# Altium schematic sheet CD74HC4067_MUX_4.SchDoc
size A
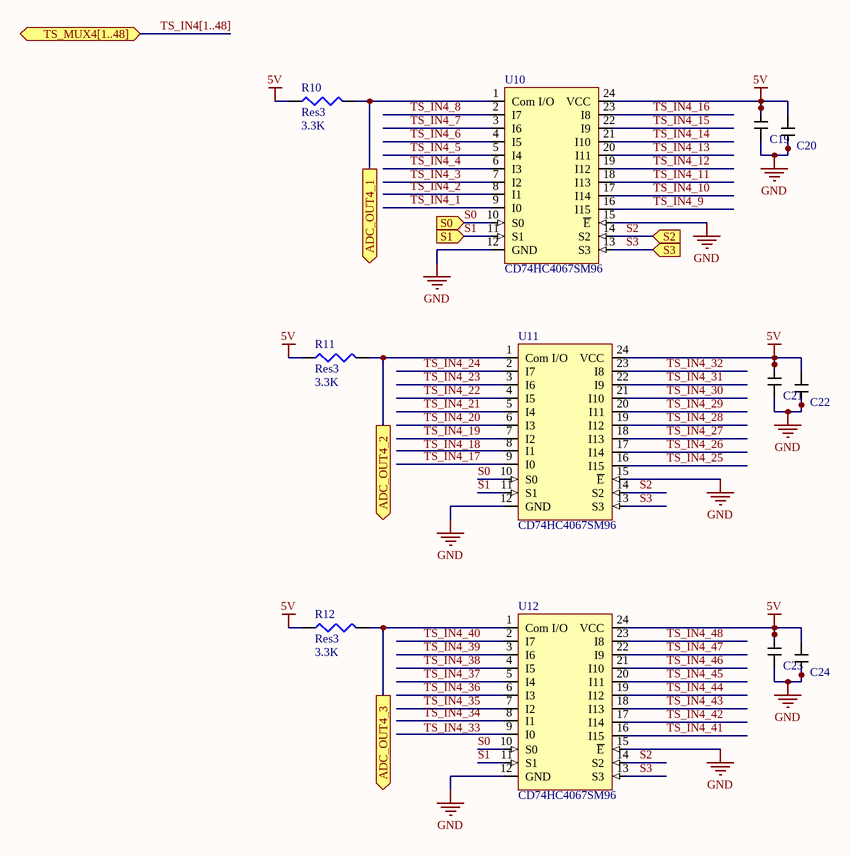
[diagram p0: CD74HC4067_MUX_4.SchDoc]

## Parts
C19  0.1uF Cap  [CAPC1608X09M]  (value not drawn)
C20  1uF Samsung Cap  [CAPC1608X09M]  (value not drawn)
C21  0.1uF Cap  [CAPC1608X09M]  (value not drawn)
C22  1uF Samsung Cap  [CAPC1608X09M]  (value not drawn)
C23  0.1uF Cap  [CAPC1608X09M]  (value not drawn)
C24  1uF Samsung Cap  [CAPC1608X09M]  (value not drawn)
R10  Res3  value 3.3K  [J1-0603]
R11  Res3  value 3.3K  [J1-0603]
R12  Res3  value 3.3K  [J1-0603]
U10  CD74HC4067SM96  [SOIC-24_MUX]
U11  CD74HC4067SM96  [SOIC-24_MUX]
U12  CD74HC4067SM96  [SOIC-24_MUX]

## Ports
ADC_OUT4_1 (out), ADC_OUT4_2 (out), ADC_OUT4_3 (out), S0 (in), S1 (in), S2 (in), S3 (in), TS_MUX4[1..48] (bidir)

## Nets
5V: C19.2 C20.2 C21.2 C22.2 C23.2 C24.2 R10.1 R11.1 R12.1 U10.24(VCC) U11.24(VCC) U12.24(VCC)
GND: C19.1 C20.1 C21.1 C22.1 C23.1 C24.1 U10.12(GND) U10.15(~{E}) U11.12(GND) U11.15(~{E}) U12.12(GND) U12.15(~{E})
ADC_OUT4_1: R10.2 U10.1(Com_I/O) ; port ADC_OUT4_1
ADC_OUT4_2: R11.2 U11.1(Com_I/O) ; port ADC_OUT4_2
ADC_OUT4_3: R12.2 U12.1(Com_I/O) ; port ADC_OUT4_3
S0: U10.10(S0) U11.10(S0) U12.10(S0) ; port S0
S1: U10.11(S1) U11.11(S1) U12.11(S1) ; port S1
S2: U10.14(S2) U11.14(S2) U12.14(S2) ; port S2
S3: U10.13(S3) U11.13(S3) U12.13(S3) ; port S3
TS_IN4_1: U10.9(I0)
TS_IN4_2: U10.8(I1)
TS_IN4_3: U10.7(I2)
TS_IN4_4: U10.6(I3)
TS_IN4_5: U10.5(I4)
TS_IN4_6: U10.4(I5)
TS_IN4_7: U10.3(I6)
TS_IN4_8: U10.2(I7)
TS_IN4_9: U10.16(I15)
TS_IN4_10: U10.17(I14)
TS_IN4_11: U10.18(I13)
TS_IN4_12: U10.19(I12)
TS_IN4_13: U10.20(I11)
TS_IN4_14: U10.21(I10)
TS_IN4_15: U10.22(I9)
TS_IN4_16: U10.23(I8)
TS_IN4_17: U11.9(I0)
TS_IN4_19: U11.7(I2)
TS_IN4_20: U11.6(I3)
TS_IN4_21: U11.5(I4)
TS_IN4_22: U11.4(I5)
TS_IN4_23: U11.3(I6)
TS_IN4_24: U11.2(I7)
TS_IN4_25: U11.16(I15)
TS_IN4_26: U11.17(I14)
TS_IN4_27: U11.18(I13)
TS_IN4_28: U11.19(I12)
TS_IN4_29: U11.20(I11)
TS_IN4_30: U11.21(I10)
TS_IN4_31: U11.22(I9)
TS_IN4_32: U11.23(I8)
TS_IN4_34: U12.8(I1)
TS_IN4_35: U12.7(I2)
TS_IN4_36: U12.6(I3)
TS_IN4_37: U12.5(I4)
TS_IN4_38: U12.4(I5)
TS_IN4_39: U12.3(I6)
TS_IN4_40: U12.2(I7)
TS_IN4_41: U12.16(I15)
TS_IN4_42: U12.17(I14)
TS_IN4_43: U12.18(I13)
TS_IN4_44: U12.19(I12)
TS_IN4_45: U12.20(I11)
TS_IN4_46: U12.21(I10)
TS_IN4_47: U12.22(I9)
TS_IN4_48: U12.23(I8)

Not connected (* = marked no-connect by the designer): U11 8(I1); U12 9(I0)

## Buses and harness runs
bus TS_IN4[1..48] = port TS_MUX4[1..48]

## Notes on the sheet
- Labels drawn without touching a wire or pin: TS_IN4_18, TS_IN4_33

## Library data of the parts
C19 C21 C23 = 0.1uF Cap: C0603C101K8GAC7867 Kemet Capacitor; Supplier 1: Digi-Key; Supplier Part Number 1: 399-14477-1-ND
R10-R12 = Res3: Resistor; Published: 8-Jun-2000; LatestRevisionDate: 29-May-2009; LatestRevisionNote: IPC-7351 Footprint Added.; PackageReference: J1-0603; Publisher: Altium Limited; PackageDescription: Chip Resistor
C20 C22 C24 = 1uF Samsung Cap: Supplier 1: Digi-Key; Supplier Part Number 1: 1276-1946-1-ND
U10-U12 = CD74HC4067SM96: Supplier Part Number 1: 05B6161; Supplier 1: Newark